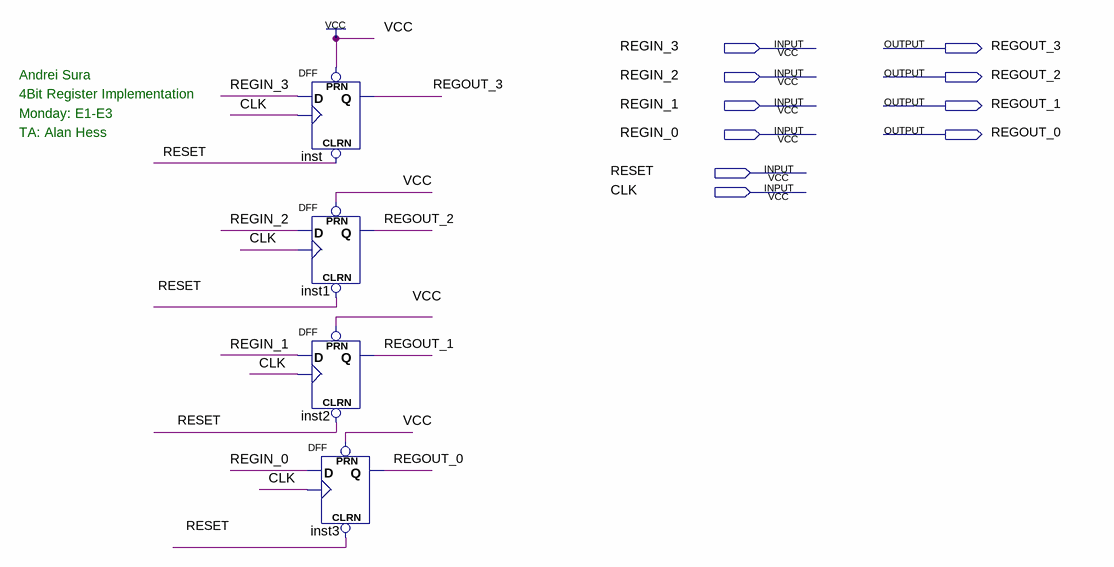
[diagram p0: schematic sheet]
// Quartus schematic 4bit_reg.bdf as structural Verilog: 4 symbols, 10 pins
module \4bit_reg  (
  input  REGIN_3,
  input  REGIN_2,
  input  REGIN_1,
  input  REGIN_0,
  input  RESET,
  input  CLK,
  output REGOUT_3,
  output REGOUT_2,
  output REGOUT_1,
  output REGOUT_0
);

  DFF inst (.CLRN(RESET), .CLK(CLK), .D(REGIN_3), .PRN(1'b1), .Q(REGOUT_3));
  DFF inst1 (.CLRN(RESET), .CLK(CLK), .D(REGIN_2), .PRN(1'b1), .Q(REGOUT_2));
  DFF inst2 (.CLRN(RESET), .CLK(CLK), .D(REGIN_1), .PRN(1'b1), .Q(REGOUT_1));
  DFF inst3 (.CLRN(RESET), .CLK(CLK), .D(REGIN_0), .PRN(1'b1), .Q(REGOUT_0));

  // Notes on the sheet:
  //   Andrei Sura
  //   4Bit Register Implementation
  //   Monday: E1-E3
  //   TA: Alan Hess
endmodule
